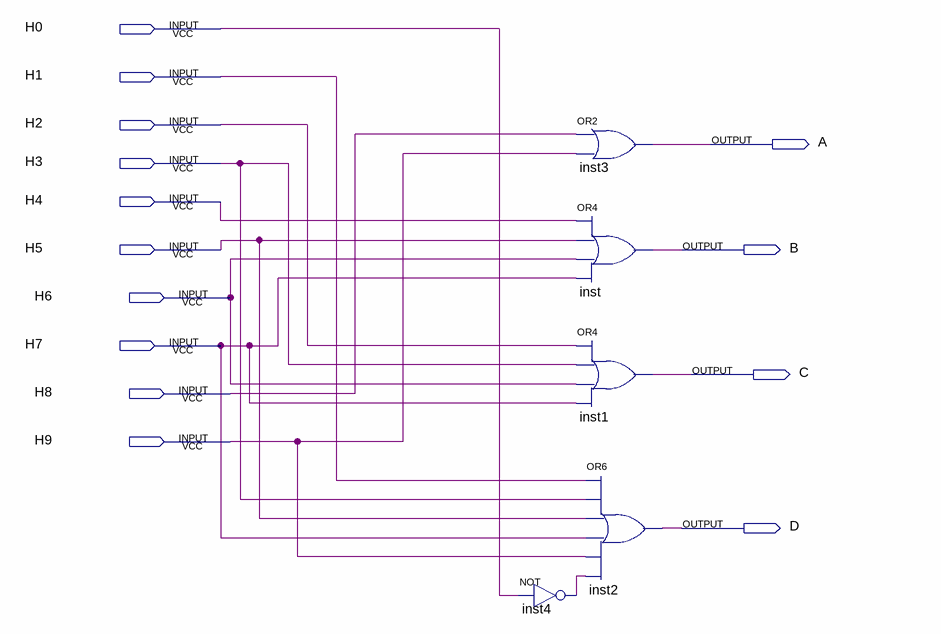
[diagram p0: schematic sheet]
// Quartus schematic Codificador.bdf as structural Verilog: 5 symbols, 14 pins
module Codificador (
  input  H0,
  input  H1,
  input  H2,
  input  H3,
  input  H4,
  input  H5,
  input  H6,
  input  H7,
  input  H8,
  input  H9,
  output A,
  output B,
  output C,
  output D
);

  wire inst4_out;

  not inst4 (inst4_out, H0);
  or inst3 (A, H8, H9);
  or inst (B, H4, H5, H6, H7);
  or inst1 (C, H2, H3, H6, H7);
  or inst2 (D, H1, H3, H5, H7, H9, inst4_out);
endmodule
